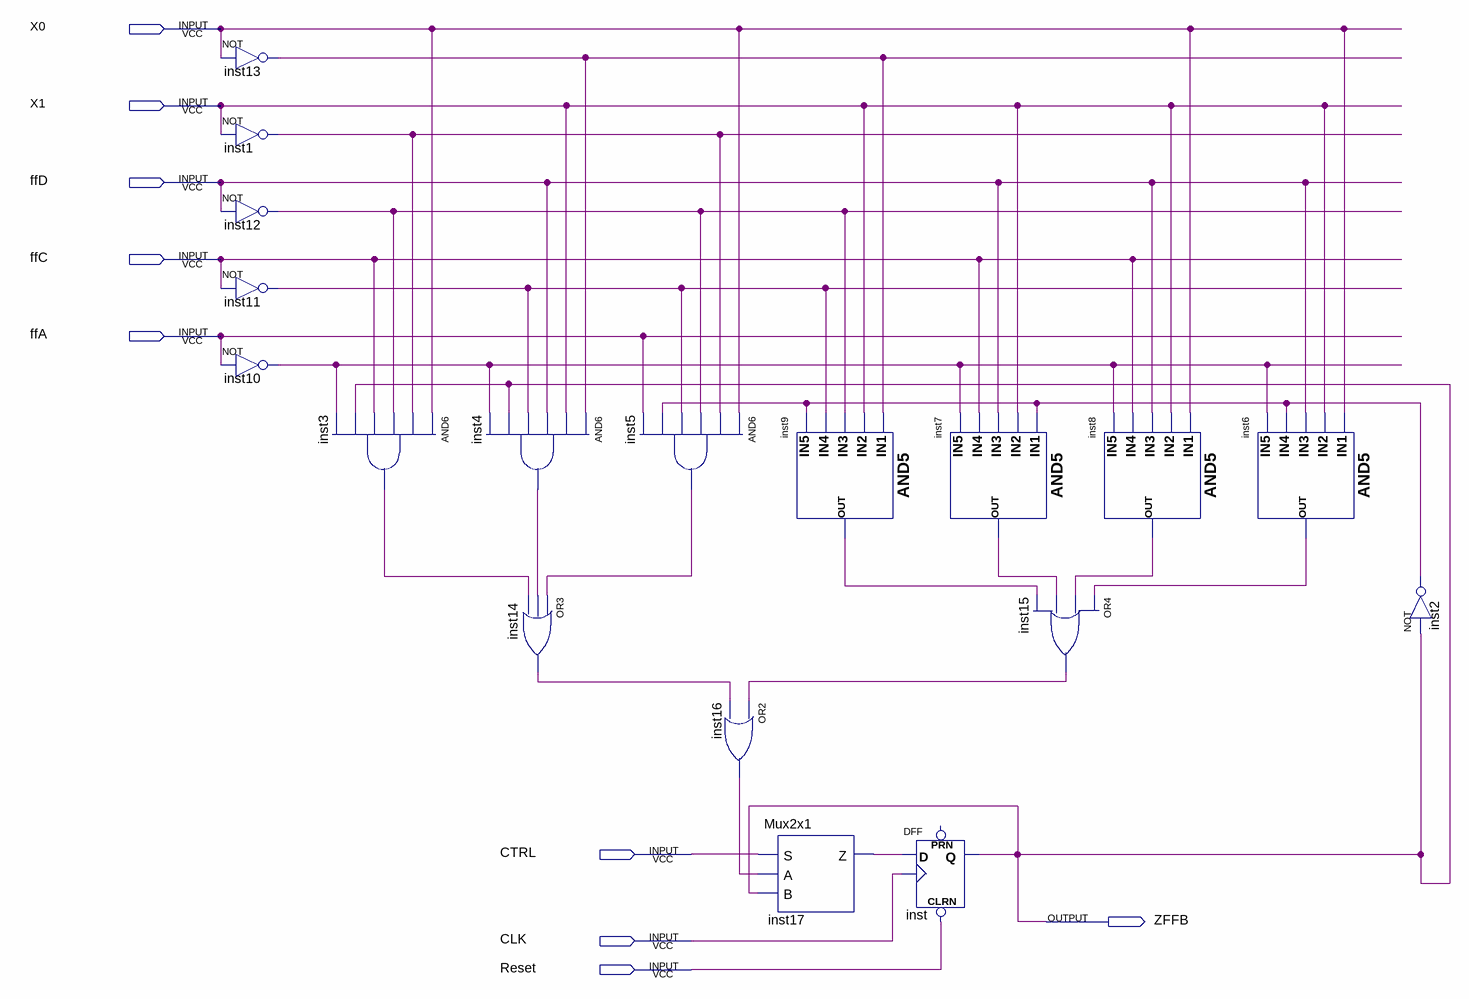
[diagram p0: schematic sheet]
// Quartus schematic EquacaoFFB.bdf as structural Verilog: 18 symbols, 9 pins
module EquacaoFFB (
  input  X0,
  input  X1,
  input  ffD,
  input  ffC,
  input  ffA,
  input  CTRL,
  input  CLK,
  input  Reset,
  output ZFFB
);

  wire inst1_out, inst2_out, inst3_out, inst4_out, inst5_out, inst6_out, inst7_out, inst8_out, inst9_out,
       inst10_out, inst11_out, inst12_out, inst13_out, inst14_out, inst15_out, inst16_out, inst17_z;

  not inst13 (inst13_out, X0);
  not inst1 (inst1_out, X1);
  not inst12 (inst12_out, ffD);
  not inst11 (inst11_out, ffC);
  not inst10 (inst10_out, ffA);
  and inst3 (inst3_out, X0, inst1_out, inst12_out, ffC, ZFFB, inst10_out);
  and inst4 (inst4_out, inst13_out, X1, ffD, inst11_out, ZFFB, inst10_out);
  or inst14 (inst14_out, inst5_out, inst4_out, inst3_out);
  and inst5 (inst5_out, X0, inst1_out, inst12_out, inst11_out, inst2_out, ffA);
  or inst16 (inst16_out, inst15_out, inst14_out);
  and inst9 (inst9_out, inst13_out, X1, inst12_out, inst11_out, inst2_out);
  Mux2x1 inst17 (.S(CTRL), .A(inst16_out), .B(ZFFB), .Z(inst17_z));
  and inst7 (inst7_out, inst2_out, X1, ffD, ffC, inst10_out);
  DFF inst (.CLRN(Reset), .CLK(CLK), .D(inst17_z), .Q(ZFFB));  // open: PRN
  or inst15 (inst15_out, inst6_out, inst8_out, inst7_out, inst9_out);
  and inst8 (inst8_out, X0, X1, ffD, ffC, inst10_out);
  and inst6 (inst6_out, X0, X1, ffD, inst2_out, inst10_out);
  not inst2 (inst2_out, ZFFB);
endmodule
